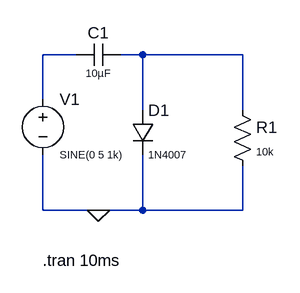
[diagram p0: schematic negative-clamper.asc]
negative-clamper.asc, the LTspice schematic file:
Version 4.1
SHEET 1 880 680
WIRE 64 64 16 64
WIRE 160 64 128 64
WIRE 304 64 160 64
WIRE 16 128 16 64
WIRE 160 144 160 64
WIRE 304 144 304 64
WIRE 16 288 16 208
WIRE 96 288 16 288
WIRE 160 288 160 208
WIRE 160 288 96 288
WIRE 304 288 304 224
WIRE 304 288 160 288
FLAG 96 288 0
SYMBOL voltage 16 112 R0
WINDOW 3 24 96 Left 1
SYMATTR InstName V1
SYMATTR Value SINE(0 5 1k)
SYMBOL cap 128 48 R90
WINDOW 0 0 32 VBottom 2
WINDOW 3 32 32 VTop 1
SYMATTR InstName C1
SYMATTR Value 10µF
SYMBOL diode 144 144 R0
WINDOW 3 24 64 Left 1
SYMATTR InstName D1
SYMATTR Value 1N4007
SYMBOL res 288 128 R0
WINDOW 3 36 76 Left 1
SYMATTR InstName R1
SYMATTR Value 10k
TEXT 16 360 Left 2 !.tran 10ms

The netlist it stands for:
* negative-clamper.asc
V1 N001 0 SINE(0 5 1k)
C1 N002 N001 10µF
D1 N002 0 1N4007
R1 N002 0 10k
.model D D
.lib standard.dio
.tran 10ms
.backanno
.end